# Altium schematic sheet pcb1.SchDoc
size A4; SheetNumber: 1; SheetTotal: 1
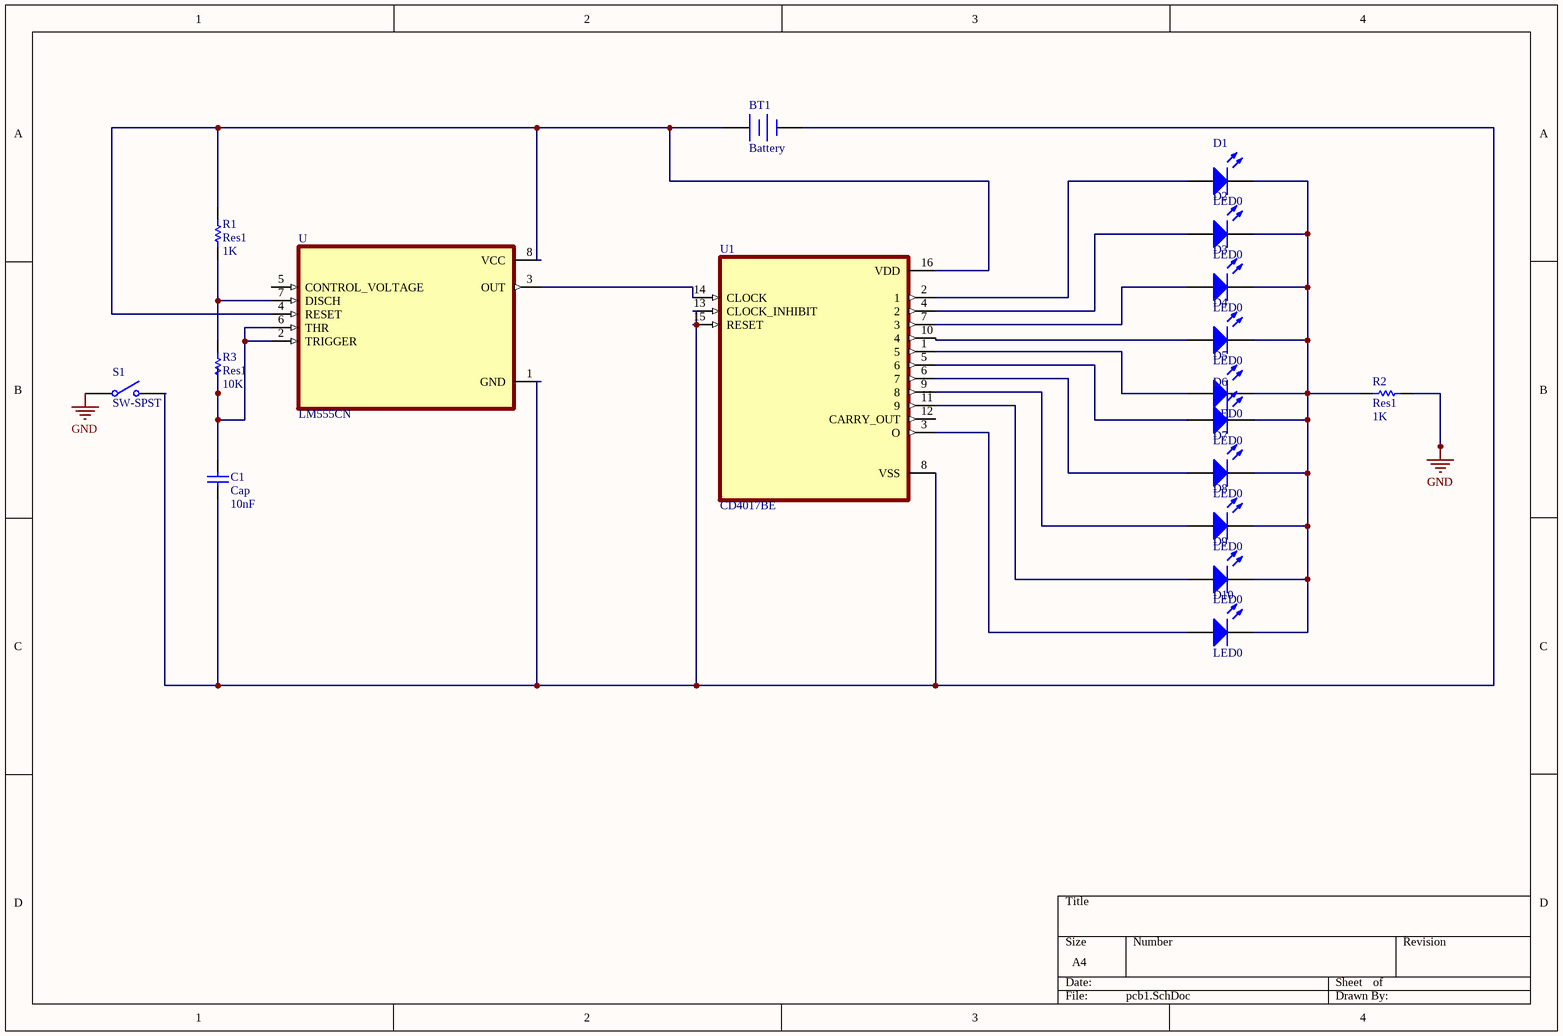
[diagram p0: pcb1.SchDoc]

## Parts
BT1  Battery  [BAT-2]
C1  Cap  value 10nF  [RAD-0.3]
D1  LED0  [LED-0]
D2  LED0  [LED-0]
D3  LED0  [LED-0]
D4  LED0  [LED-0]
D5  LED0  [LED-0]
D6  LED0  [LED-0]
D7  LED0  [LED-0]
D8  LED0  [LED-0]
D9  LED0  [LED-0]
D10  LED0  [LED-0]
R1  Res1  value 1K  [AXIAL-0.3]
R2  Res1  value 1K  [AXIAL-0.3]
R3  Res1  value 10K  [AXIAL-0.3]
S1  SW-SPST  [SPST-2]
U  LM555CN  [DIP762W46P254L960H508Q8]
U1  CD4017BE  [DIP794W45P254L1969H508Q16]

## Nets
GND: R2.1 S1.1(COMMON)
NetBT1_1: BT1.1(+) R1.2 U.4(RESET) U.8(VCC) U1.16(VDD)
NetBT1_2: BT1.2(-) C1.1 S1.2(NO) U.1(GND) U1.8(VSS) U1.13(CLOCK_INHIBIT) U1.15(RESET)
NetC1_2: C1.2 R3.1 U.2(TRIGGER) U.6(THR)
NetD1_1: D1.1(A) U1.2(1)
NetD1_2: D1.2(K) D2.2(K) D3.2(K) D4.2(K) D5.2(K) D6.2(K) D7.2(K) D8.2(K) D9.2(K) D10.2(K) R2.2
NetD2_1: D2.1(A) U1.4(2)
NetD3_1: D3.1(A) U1.7(3)
NetD4_1: D4.1(A) U1.10(4)
NetD5_1: D5.1(A) U1.1(5)
NetD6_1: D6.1(A) U1.5(6)
NetD7_1: D7.1(A) U1.6(7)
NetD8_1: D8.1(A) U1.9(8)
NetD9_1: D9.1(A) U1.11(9)
NetD10_1: D10.1(A) U1.3(O)
NetR1_1: R1.1 R3.2 U.7(DISCH)
NetU_3: U.3(OUT) U1.14(CLOCK)

Not connected (* = marked no-connect by the designer): U 5(CONTROL_VOLTAGE); U1 12(CARRY_OUT)

## Library data of the parts
BT1 = Battery: Multicell Battery; Published: 24-Mar-1999; LatestRevisionDate: 17-Jul-2002; LatestRevisionNote: Re-released for DXP Platform.; PackageReference: BAT-2; Publisher: Altium Limited; PackageDescription: Battery; 2 Leads
C1 = Cap: Capacitor; Published: 8-Jun-2000; LatestRevisionDate: 17-Jul-2002; LatestRevisionNote: Re-released for DXP Platform.; PackageReference: RAD-0.3; Publisher: Altium Limited; PackageDescription: Radial Cap, Thru-Hole; 2 Leads; 0.3 in Pin Spacing
D1-D10 = LED0: Typical INFRARED GaAs LED; Published: 8-Jun-2000; LatestRevisionDate: 08-Jul-2005; LatestRevisionNote: Mech Layer 1 removed.; PackageReference: LED-0; Publisher: Altium Limited; PackageDescription: LED; 2 Leads
R1-R3 = Res1: Resistor; Published: 8-Jun-2000; LatestRevisionDate: 17-Jul-2002; LatestRevisionNote: Re-released for DXP Platform.; PackageReference: AXIAL-0.3; Publisher: Altium Limited; PackageDescription: Axial Device, Thru-Hole; 2 Leads; 0.3 in Pin Spacing
S1 = SW-SPST: Single-Pole, Single-Throw Switch; Published: 24-Mar-1999; LatestRevisionDate: 17-Jul-2002; LatestRevisionNote: Re-released for DXP Platform.; PackageReference: SPST-2; Publisher: Altium Limited; PackageDescription: Switch; 2 Leads
U = LM555CN: 555 Type, Timer/Oscillator (Single) IC 100kHz 8-PDIP; MF: Texas Instruments; SnapEDA_Link: https://www.snapeda.com/parts/LM555CN/Texas%20Instruments/view-part/2617191/?ref=snap; Value: *; MP: LM555CN; Availability: Unavailable; Package: DIP-8 Intersil; Price: None
U1 = CD4017BE: CMOS Decade Counter with 10 Decoded Outputs; MF: Texas Instruments; Value: *; Check_prices: https://www.snapeda.com/parts/CD4017BE/Texas+Instruments/view-part/?ref=eda; Availability: In Stock; Package: PDIP-16 Texas Instruments; SnapEDA_Link: https://www.snapeda.com/parts/CD4017BE/Texas+Instruments/view-part/?ref=snap; Purchase-URL: https://pricing.snapeda.com/search/part/CD4017BE/?ref=eda; Price: None; MP: CD4017BE